# Altium schematic sheet Battery-Cutoff.SchDoc
size A4
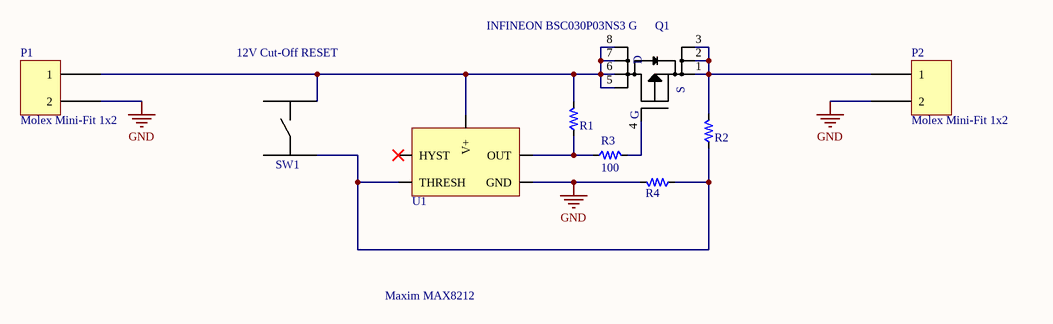
[diagram p0: Battery-Cutoff.SchDoc]

## Parts
P1  Molex Mini-Fit 1x2  [Molex Mini-Fit Jr 2x1]
P2  Molex Mini-Fit 1x2  [Molex Mini-Fit Jr 2x1]
Q1  INFINEON BSC030P03NS3 G  [BSC030P03NS3 G]
R1  SCH_GENERIC_RESISTOR_0603  [PCB_GENERIC_SMD_0603]  (value not drawn)
R2  SCH_GENERIC_RESISTOR_0603  [PCB_GENERIC_SMD_0603]  (value not drawn)
R3  Resistance: 100  [PCB_GENERIC_SMD_0603]  (hidden comment: SCH_GENERIC_RESISTOR_0603)
R4  SCH_GENERIC_RESISTOR_0603  [PCB_GENERIC_SMD_0603]  (value not drawn)
SW1  Tactile Switch  [C&K 4 pin Tactile Switch]  (value not drawn)
U1  Maxim MAX8212  [Maxim MAX8212]

## Nets
GND: P1.2 P2.2 R4.2 U1.5(GND)
NetP1_1: P1.1 Q1.5(D) Q1.6(D) Q1.7(D) Q1.8(D) R1.2 SW1.3 U1.8(V+)
NetP2_1: P2.1 Q1.1(S) Q1.2(S) Q1.3(S) R2.2
NetQ1_4: Q1.4(G) R3.2
NetR1_1: R1.1 R3.1 U1.4(OUT)
NetR2_1: R2.1 R4.1 SW1.1 U1.3(THRESH)

Not connected (* = marked no-connect by the designer): SW1 2 4; U1 2(HYST)*

## Notes on the sheet
- (near SW1) 12V Cut-Off RESET

## Library data of the parts
Q1 = BSC030P03NS3 G: P-Channel 30V 25.4A (Ta), 100A (Tc) 2.5W (Ta), 125W (Tc) Surface Mount PG-TDSON-8; Digikey Part No.: BSC030P03NS3 GCT-ND
R1-R4 = SCH_GENERIC_RESISTOR_0603: Generic SMD resistor 0603
  R1 R2 R4: Resistance: *
SW1 = C&K Tactile Switch